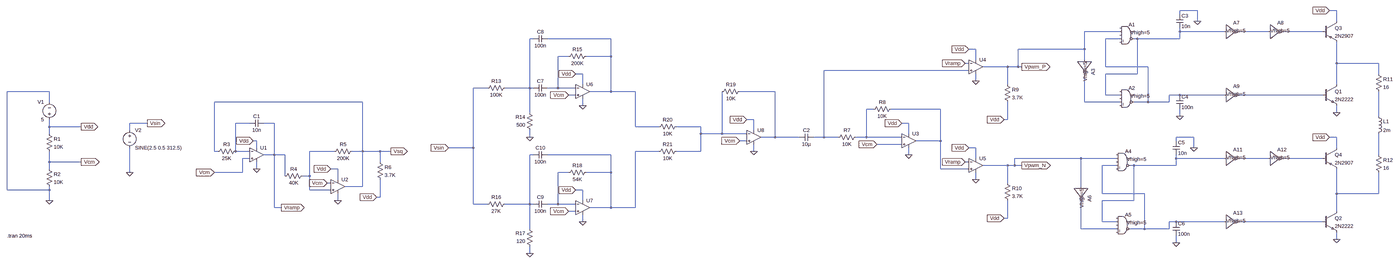
[diagram p0: schematic TOP LEVEL INTEGRATION.asc, whole sheet]
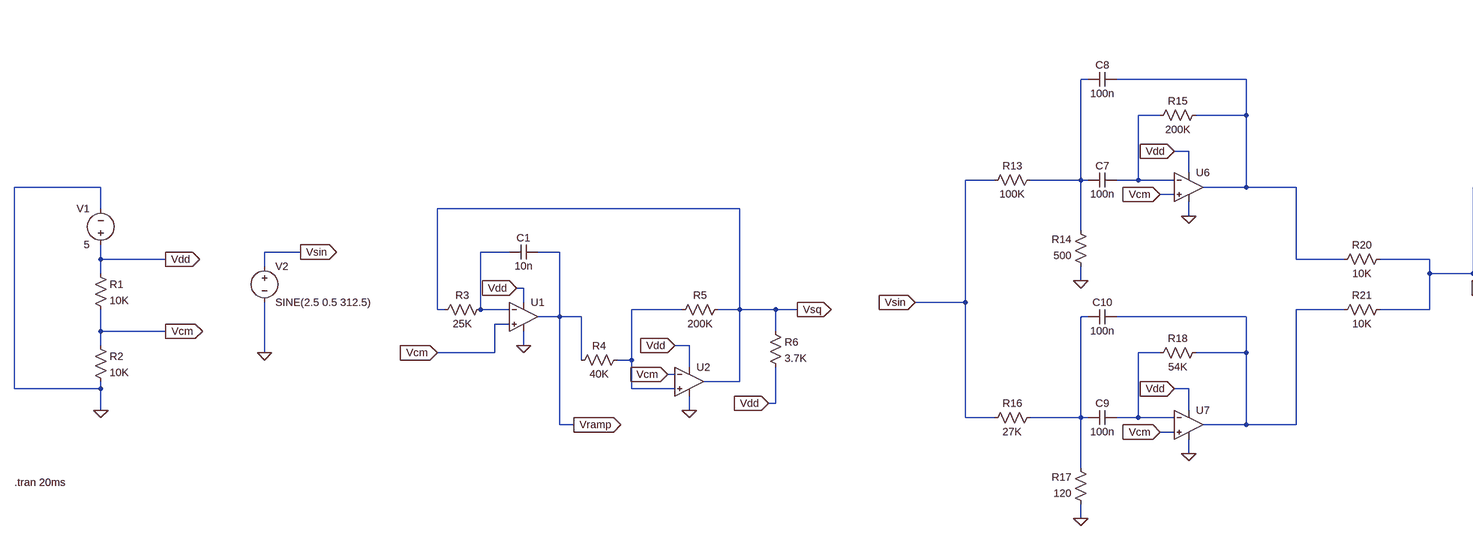
[diagram p1: schematic TOP LEVEL INTEGRATION.asc, part, row 1 of 1, column 1 of 2]
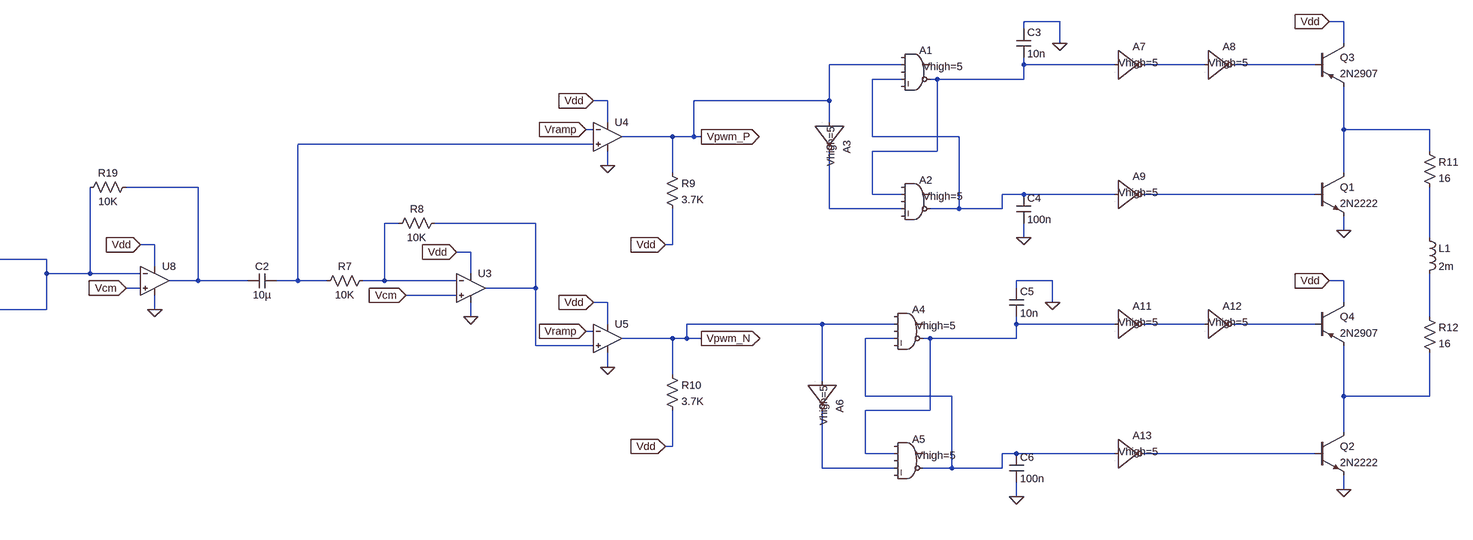
[diagram p2: schematic TOP LEVEL INTEGRATION.asc, part, row 1 of 1, column 2 of 2]
TOP LEVEL INTEGRATION.asc, the LTspice schematic file:
Version 4.1
SHEET 1 3748 680
WIRE 2416 -608 2336 -608
WIRE 3392 -608 3360 -608
WIRE 2336 -592 2336 -608
WIRE 2416 -560 2416 -608
WIRE 3392 -560 3392 -608
WIRE 2064 -512 1904 -512
WIRE 2336 -512 2336 -528
WIRE 2640 -512 2336 -512
WIRE 2928 -512 2704 -512
WIRE 3328 -512 2992 -512
WIRE -1088 -480 -1104 -480
WIRE -736 -480 -1024 -480
WIRE 2064 -480 2000 -480
WIRE 2144 -480 2128 -480
WIRE 2336 -480 2336 -512
WIRE 2336 -480 2144 -480
WIRE 1248 -432 1216 -432
WIRE 1904 -432 1904 -512
WIRE 1904 -432 1440 -432
WIRE -928 -400 -976 -400
WIRE -736 -400 -736 -480
WIRE -736 -400 -848 -400
WIRE 1248 -384 1248 -432
WIRE 1904 -384 1904 -432
WIRE 1216 -368 1200 -368
WIRE 3392 -368 3392 -464
WIRE 3680 -368 3392 -368
WIRE 1392 -352 1280 -352
WIRE 1440 -352 1440 -432
WIRE 1440 -352 1392 -352
WIRE 1456 -352 1440 -352
WIRE 2000 -352 2000 -480
WIRE 2192 -352 2000 -352
WIRE 1216 -336 560 -336
WIRE -864 -320 -896 -320
WIRE 2144 -320 2144 -480
WIRE 2144 -320 2000 -320
WIRE 3680 -320 3680 -368
WIRE 1248 -288 1248 -320
WIRE -864 -272 -864 -320
WIRE 1392 -272 1392 -352
WIRE 3392 -272 3392 -368
WIRE -1296 -256 -1360 -256
WIRE -1104 -256 -1104 -480
WIRE -1104 -256 -1216 -256
WIRE -1088 -256 -1104 -256
WIRE -976 -256 -976 -400
WIRE -976 -256 -1024 -256
WIRE -896 -256 -976 -256
WIRE -3600 -240 -3792 -240
WIRE -736 -240 -736 -400
WIRE -736 -240 -832 -240
WIRE -624 -240 -736 -240
WIRE 176 -240 16 -240
WIRE -896 -224 -928 -224
WIRE 2000 -224 2000 -320
WIRE 2064 -224 2000 -224
WIRE 2336 -224 2288 -224
WIRE 2640 -224 2336 -224
WIRE 3328 -224 2704 -224
WIRE -3600 -192 -3600 -240
WIRE -2112 -192 -2784 -192
WIRE 1904 -192 1904 -320
WIRE 2064 -192 1904 -192
WIRE 2192 -192 2192 -352
WIRE 2192 -192 2128 -192
WIRE 2288 -192 2288 -224
WIRE 2288 -192 2192 -192
WIRE -864 -176 -864 -208
WIRE 784 -160 752 -160
WIRE 1088 -160 864 -160
WIRE -1104 -144 -1104 -256
WIRE 3392 -144 3392 -176
WIRE 2336 -128 2336 -160
WIRE 3680 -128 3680 -240
WIRE 80 -112 48 -112
WIRE 1392 -112 1392 -192
WIRE 1392 -112 1376 -112
WIRE -3088 -96 -3168 -96
WIRE -2624 -96 -2688 -96
WIRE -2512 -96 -2560 -96
WIRE 944 -96 912 -96
WIRE -3600 -80 -3600 -112
WIRE -3456 -80 -3600 -80
WIRE -624 -80 -624 -240
WIRE -384 -80 -624 -80
WIRE -160 -80 -304 -80
WIRE -3168 -64 -3168 -96
WIRE 80 -64 80 -112
WIRE -3600 -48 -3600 -80
WIRE -160 -48 -160 -80
WIRE -64 -48 -64 -240
WIRE -64 -48 -160 -48
WIRE 48 -48 -64 -48
WIRE 944 -48 944 -96
WIRE -1104 -32 -1104 -64
WIRE 176 -32 176 -240
WIRE 176 -32 112 -32
WIRE 448 -32 176 -32
WIRE 560 -32 560 -336
WIRE 560 -32 512 -32
WIRE 624 -32 560 -32
WIRE 752 -32 752 -160
WIRE 752 -32 704 -32
WIRE 912 -32 752 -32
WIRE 2400 -32 2320 -32
WIRE 3392 -32 3360 -32
WIRE -2592 -16 -2608 -16
WIRE 48 -16 16 -16
WIRE 1088 -16 1088 -160
WIRE 1088 -16 976 -16
WIRE 2320 -16 2320 -32
WIRE 912 0 800 0
WIRE -2592 16 -2592 -16
WIRE -1360 16 -1360 -256
WIRE -1360 16 -1552 16
WIRE 1248 16 1216 16
WIRE 2400 16 2400 -32
WIRE 3392 16 3392 -32
WIRE -2784 32 -2784 -192
WIRE -2768 32 -2784 32
WIRE -2688 32 -2688 -96
WIRE -2624 32 -2688 32
WIRE -2240 32 -2352 32
WIRE -2112 32 -2112 -192
WIRE -2112 32 -2160 32
WIRE -2032 32 -2112 32
WIRE -1984 32 -2032 32
WIRE -384 32 -624 32
WIRE -160 32 -160 -48
WIRE -160 32 -304 32
WIRE 80 32 80 0
WIRE -2512 48 -2512 -96
WIRE -2512 48 -2560 48
WIRE -2464 48 -2512 48
WIRE -1088 48 -1104 48
WIRE -736 48 -1024 48
WIRE 944 48 944 16
WIRE 3680 48 3680 -48
WIRE -2624 64 -2656 64
WIRE 1248 64 1248 16
WIRE 1888 64 1424 64
WIRE 2048 64 1888 64
WIRE 2320 64 2320 48
WIRE 2640 64 2320 64
WIRE 2928 64 2704 64
WIRE 3328 64 2992 64
WIRE -3600 80 -3600 32
WIRE -3456 80 -3600 80
WIRE -2032 80 -2032 32
WIRE 1216 80 1200 80
WIRE 1392 96 1280 96
WIRE 1424 96 1424 64
WIRE 1424 96 1392 96
WIRE 1456 96 1424 96
WIRE 2048 96 1984 96
WIRE 2128 96 2112 96
WIRE 2320 96 2320 64
WIRE 2320 96 2128 96
WIRE -3600 112 -3600 80
WIRE -2592 112 -2592 80
WIRE -2224 112 -2256 112
WIRE 1088 112 1088 -16
WIRE 1216 112 1088 112
WIRE -3168 128 -3168 16
WIRE -2656 128 -2656 64
WIRE -2656 128 -2784 128
WIRE -928 128 -976 128
WIRE -736 128 -736 48
WIRE -736 128 -848 128
WIRE -2464 144 -2464 48
WIRE -2352 144 -2352 32
WIRE -2352 144 -2384 144
WIRE -2224 160 -2224 112
WIRE 1248 160 1248 128
WIRE -2256 176 -2272 176
WIRE 1392 176 1392 96
WIRE -2112 192 -2112 32
WIRE -2112 192 -2192 192
WIRE 1888 192 1888 64
WIRE -3792 208 -3792 -240
WIRE -3600 208 -3600 192
WIRE -3600 208 -3792 208
WIRE -2352 208 -2352 144
WIRE -2256 208 -2352 208
WIRE -864 208 -896 208
WIRE 1984 224 1984 96
WIRE 2176 224 1984 224
WIRE 3392 224 3392 112
WIRE 3680 224 3680 128
WIRE 3680 224 3392 224
WIRE -2032 240 -2032 160
WIRE -2032 240 -2048 240
WIRE -3600 256 -3600 208
WIRE -2224 256 -2224 224
WIRE -864 256 -864 208
WIRE 2128 256 2128 96
WIRE 2128 256 1984 256
WIRE -1360 272 -1360 16
WIRE -1296 272 -1360 272
WIRE -1104 272 -1104 48
WIRE -1104 272 -1216 272
WIRE -1088 272 -1104 272
WIRE -976 272 -976 128
WIRE -976 272 -1024 272
WIRE -896 272 -976 272
WIRE -2512 288 -2512 48
WIRE -2480 288 -2512 288
WIRE -736 288 -736 128
WIRE -736 288 -832 288
WIRE -624 288 -624 32
WIRE -624 288 -736 288
WIRE -896 304 -928 304
WIRE 3392 304 3392 224
WIRE 1392 336 1392 256
WIRE 1392 336 1376 336
WIRE -864 352 -864 320
WIRE 1984 352 1984 256
WIRE 2048 352 1984 352
WIRE 2320 352 2288 352
WIRE 2640 352 2320 352
WIRE 3328 352 2704 352
WIRE -1104 384 -1104 272
WIRE 1888 384 1888 256
WIRE 2048 384 1888 384
WIRE 2176 384 2176 224
WIRE 2176 384 2112 384
WIRE 2288 384 2288 352
WIRE 2288 384 2176 384
WIRE 3392 432 3392 400
WIRE 2320 448 2320 416
WIRE -1104 496 -1104 464
FLAG -3600 256 0
FLAG -3456 80 Vcm
IOPIN -3456 80 Out
FLAG -3456 -80 Vdd
IOPIN -3456 -80 Out
FLAG -2784 128 Vcm
IOPIN -2784 128 In
FLAG -2608 -16 Vdd
IOPIN -2608 -16 In
FLAG -2256 112 Vdd
IOPIN -2256 112 In
FLAG -2592 112 0
FLAG -2224 256 0
FLAG -2272 176 Vcm
IOPIN -2272 176 In
FLAG -2480 288 Vramp
IOPIN -2480 288 Out
FLAG -1984 32 Vsq
IOPIN -1984 32 Out
FLAG -2048 240 Vdd
IOPIN -2048 240 In
FLAG 912 -96 Vdd
IOPIN 912 -96 In
FLAG 944 48 0
FLAG 800 0 Vcm
IOPIN 800 0 In
FLAG -1552 16 Vsin
IOPIN -1552 16 In
FLAG -3168 128 0
FLAG -3088 -96 Vsin
IOPIN -3088 -96 Out
FLAG 1216 -432 Vdd
IOPIN 1216 -432 In
FLAG 1248 -288 0
FLAG 1200 -368 Vramp
IOPIN 1200 -368 In
FLAG 1216 16 Vdd
IOPIN 1216 16 In
FLAG 1248 160 0
FLAG 1200 80 Vramp
IOPIN 1200 80 In
FLAG 1456 -352 Vpwm_P
IOPIN 1456 -352 Out
FLAG 1456 96 Vpwm_N
IOPIN 1456 96 Out
FLAG 1376 -112 Vdd
IOPIN 1376 -112 In
FLAG 1376 336 Vdd
IOPIN 1376 336 In
FLAG 2416 -560 0
FLAG 2336 -128 0
FLAG 2400 16 0
FLAG 2320 448 0
FLAG 3392 -144 0
FLAG 3392 432 0
FLAG 3360 -608 Vdd
IOPIN 3360 -608 In
FLAG 3360 -32 Vdd
IOPIN 3360 -32 In
FLAG -896 -320 Vdd
IOPIN -896 -320 In
FLAG -864 -176 0
FLAG -1104 -32 0
FLAG -896 208 Vdd
IOPIN -896 208 In
FLAG -864 352 0
FLAG -1104 496 0
FLAG 48 -112 Vdd
IOPIN 48 -112 In
FLAG 80 32 0
FLAG -928 -224 Vcm
IOPIN -928 -224 In
FLAG -928 304 Vcm
IOPIN -928 304 In
FLAG 16 -16 Vcm
IOPIN 16 -16 In
SYMBOL res -3616 -64 R0
SYMATTR InstName R1
SYMATTR Value 10K
SYMBOL res -3616 96 R0
SYMATTR InstName R2
SYMATTR Value 10K
SYMBOL OpAmps\\UniversalOpAmp1 -2592 48 R0
SYMATTR InstName U1
SYMBOL res -2672 16 R90
WINDOW 0 0 56 VBottom 2
WINDOW 3 32 56 VTop 2
SYMATTR InstName R3
SYMATTR Value 25K
SYMBOL voltage -3600 -96 R180
WINDOW 0 24 96 Left 2
WINDOW 3 24 16 Left 2
WINDOW 123 0 0 Left 0
WINDOW 39 0 0 Left 0
SYMATTR InstName V1
SYMATTR Value 5
SYMBOL OpAmps\\UniversalOpAmp2 -2224 192 R0
SYMATTR InstName U2
SYMBOL res -2368 128 R90
WINDOW 0 0 56 VBottom 2
WINDOW 3 32 56 VTop 2
SYMATTR InstName R4
SYMATTR Value 40K
SYMBOL res -2144 16 R90
WINDOW 0 0 56 VBottom 2
WINDOW 3 32 56 VTop 2
SYMATTR InstName R5
SYMATTR Value 200K
SYMBOL cap -2560 -112 R90
WINDOW 0 0 32 VBottom 2
WINDOW 3 32 32 VTop 2
SYMATTR InstName C1
SYMATTR Value 10n
SYMBOL res -2048 64 R0
SYMATTR InstName R6
SYMATTR Value 3.7K
SYMBOL OpAmps\\UniversalOpAmp2 944 -16 R0
SYMATTR InstName U3
SYMBOL res 720 -48 R90
WINDOW 0 0 56 VBottom 2
WINDOW 3 32 56 VTop 2
SYMATTR InstName R7
SYMATTR Value 10K
SYMBOL res 880 -176 R90
WINDOW 0 0 56 VBottom 2
WINDOW 3 32 56 VTop 2
SYMATTR InstName R8
SYMATTR Value 10K
SYMBOL cap 448 -48 M90
WINDOW 0 0 32 VBottom 2
WINDOW 3 32 32 VTop 2
SYMATTR InstName C2
SYMATTR Value 10µ
SYMATTR SpiceLine Irms=0
SYMBOL voltage -3168 -80 R0
WINDOW 123 0 0 Left 0
WINDOW 39 0 0 Left 0
SYMATTR InstName V2
SYMATTR Value SINE(2.5 0.5 312.5)
SYMBOL OpAmps\\UniversalOpAmp2 1248 -352 R0
SYMATTR InstName U4
SYMBOL OpAmps\\UniversalOpAmp2 1248 96 R0
SYMATTR InstName U5
SYMBOL res 1376 -288 R0
SYMATTR InstName R9
SYMATTR Value 3.7K
SYMBOL res 1376 160 R0
SYMATTR InstName R10
SYMATTR Value 3.7K
SYMBOL Digital\\and 2096 -560 R0
WINDOW 3 16 52 Left 2
SYMATTR InstName A1
SYMATTR Value Vhigh=5
SYMBOL Digital\\and 2096 -272 R0
WINDOW 3 16 52 Left 2
SYMATTR InstName A2
SYMATTR Value Vhigh=5
SYMBOL Digital\\inv 1968 -384 R90
WINDOW 3 8 60 Left 2
SYMATTR InstName A3
SYMATTR Value Vhigh=5
SYMBOL cap 2320 -592 R0
SYMATTR InstName C3
SYMATTR Value 10n
SYMBOL cap 2320 -224 R0
SYMATTR InstName C4
SYMATTR Value 100n
SYMBOL Digital\\and 2080 16 R0
WINDOW 3 16 52 Left 2
SYMATTR InstName A4
SYMATTR Value Vhigh=5
SYMBOL Digital\\and 2080 304 R0
WINDOW 3 16 52 Left 2
SYMATTR InstName A5
SYMATTR Value Vhigh=5
SYMBOL Digital\\inv 1952 192 R90
WINDOW 3 8 60 Left 2
SYMATTR InstName A6
SYMATTR Value Vhigh=5
SYMBOL cap 2304 -16 R0
SYMATTR InstName C5
SYMATTR Value 10n
SYMBOL cap 2304 352 R0
SYMATTR InstName C6
SYMATTR Value 100n
SYMBOL Digital\\inv 2640 -576 R0
WINDOW 3 8 60 Left 2
SYMATTR InstName A7
SYMATTR Value Vhigh=5
SYMBOL Digital\\inv 2928 -576 R0
WINDOW 3 8 60 Left 2
SYMATTR InstName A8
SYMATTR Value Vhigh=5
SYMBOL Digital\\inv 2640 -288 R0
WINDOW 3 8 60 Left 2
SYMATTR InstName A9
SYMATTR Value Vhigh=5
SYMBOL npn 3328 -272 R0
SYMATTR InstName Q1
SYMATTR Value 2N2222
SYMBOL res 3664 -336 R0
SYMATTR InstName R11
SYMATTR Value 16
SYMBOL res 3664 32 R0
SYMATTR InstName R12
SYMATTR Value 16
SYMBOL Digital\\inv 2640 0 R0
WINDOW 3 8 60 Left 2
SYMATTR InstName A11
SYMATTR Value Vhigh=5
SYMBOL Digital\\inv 2928 0 R0
WINDOW 3 8 60 Left 2
SYMATTR InstName A12
SYMATTR Value Vhigh=5
SYMBOL Digital\\inv 2640 288 R0
WINDOW 3 8 60 Left 2
SYMATTR InstName A13
SYMATTR Value Vhigh=5
SYMBOL npn 3328 304 R0
SYMATTR InstName Q2
SYMATTR Value 2N2222
SYMBOL pnp 3328 -560 R0
SYMATTR InstName Q3
SYMATTR Value 2N2907
SYMBOL pnp 3328 16 R0
SYMATTR InstName Q4
SYMATTR Value 2N2907
SYMBOL OpAmps\\UniversalOpAmp2 -864 -240 R0
SYMATTR InstName U6
SYMBOL res -1200 -272 R90
WINDOW 0 0 56 VBottom 2
WINDOW 3 32 56 VTop 2
SYMATTR InstName R13
SYMATTR Value 100K
SYMBOL res -1088 -48 R180
WINDOW 0 36 76 Left 2
WINDOW 3 36 40 Left 2
SYMATTR InstName R14
SYMATTR Value 500
SYMBOL res -944 -384 R270
WINDOW 0 32 56 VTop 2
WINDOW 3 0 56 VBottom 2
SYMATTR InstName R15
SYMATTR Value 200K
SYMBOL cap -1024 -272 R90
WINDOW 0 0 32 VBottom 2
WINDOW 3 32 32 VTop 2
SYMATTR InstName C7
SYMATTR Value 100n
SYMBOL cap -1024 -496 R90
WINDOW 0 0 32 VBottom 2
WINDOW 3 32 32 VTop 2
SYMATTR InstName C8
SYMATTR Value 100n
SYMBOL OpAmps\\UniversalOpAmp2 -864 288 R0
SYMATTR InstName U7
SYMBOL res -1200 256 R90
WINDOW 0 0 56 VBottom 2
WINDOW 3 32 56 VTop 2
SYMATTR InstName R16
SYMATTR Value 27K
SYMBOL res -1088 480 R180
WINDOW 0 36 76 Left 2
WINDOW 3 36 40 Left 2
SYMATTR InstName R17
SYMATTR Value 120
SYMBOL res -944 144 R270
WINDOW 0 32 56 VTop 2
WINDOW 3 0 56 VBottom 2
SYMATTR InstName R18
SYMATTR Value 54K
SYMBOL cap -1024 256 R90
WINDOW 0 0 32 VBottom 2
WINDOW 3 32 32 VTop 2
SYMATTR InstName C9
SYMATTR Value 100n
SYMBOL cap -1024 32 R90
WINDOW 0 0 32 VBottom 2
WINDOW 3 32 32 VTop 2
SYMATTR InstName C10
SYMATTR Value 100n
SYMBOL OpAmps\\UniversalOpAmp2 80 -32 R0
SYMATTR InstName U8
SYMBOL res 32 -256 R90
WINDOW 0 0 56 VBottom 2
WINDOW 3 32 56 VTop 2
SYMATTR InstName R19
SYMATTR Value 10K
SYMBOL res -288 -96 R90
WINDOW 0 0 56 VBottom 2
WINDOW 3 32 56 VTop 2
SYMATTR InstName R20
SYMATTR Value 10K
SYMBOL res -288 16 R90
WINDOW 0 0 56 VBottom 2
WINDOW 3 32 56 VTop 2
SYMATTR InstName R21
SYMATTR Value 10K
SYMBOL ind 3664 -144 R0
SYMATTR InstName L1
SYMATTR Value 2m
SYMATTR SpiceLine Rser=1m
TEXT -3792 416 Left 2 !.tran 20ms

The netlist it stands for:
* TOP LEVEL INTEGRATION.asc
R1 Vdd Vcm 10K
R2 Vcm 0 10K
X§U1 Vcm N016 Vdd 0 Vramp level1 Avol=1Meg GBW=10Meg Vos=0 En=0 Enk=0 In=0 Ink=0 Rin=500Meg  ; pins In+ In- V+ V- OUT
R3 N016 Vsq 25K
V1 Vdd 0 5
X§U2 N018 Vcm Vdd 0 Vsq level2 Avol=1Meg GBW=10Meg Slew=10Meg Ilimit=25m Rail=0 Vos=0 En=0 Enk=0 In=0 Ink=0 Rin=500Meg  ; pins In+ In- V+ V- OUT
R4 N018 Vramp 40K
R5 Vsq N018 200K
C1 Vramp N016 10n
R6 Vsq Vdd 3.7K
X§U3 Vcm N013 Vdd 0 N014 level2 Avol=1Meg GBW=10Meg Slew=10Meg Ilimit=25m Rail=0 Vos=0 En=0 Enk=0 In=0 Ink=0 Rin=500Meg  ; pins In+ In- V+ V- OUT
R7 N013 N009 10K
R8 N014 N013 10K
C2 N010 N009 10µ Irms=0
V2 Vsin 0 SINE(2.5 0.5 312.5)
X§U4 N009 Vramp Vdd 0 Vpwm_P level2 Avol=1Meg GBW=10Meg Slew=10Meg Ilimit=25m Rail=0 Vos=0 En=0 Enk=0 In=0 Ink=0 Rin=500Meg  ; pins In+ In- V+ V- OUT
X§U5 N014 Vramp Vdd 0 Vpwm_N level2 Avol=1Meg GBW=10Meg Slew=10Meg Ilimit=25m Rail=0 Vos=0 En=0 Enk=0 In=0 Ink=0 Rin=500Meg  ; pins In+ In- V+ V- OUT
R9 Vpwm_P Vdd 3.7K
R10 Vpwm_N Vdd 3.7K
A1 0 Vpwm_P 0 N006 0 N001 0 0 AND Vhigh=5
A2 0 N001 0 N012 0 N006 0 0 AND Vhigh=5
A3 Vpwm_P 0 0 0 0 N012 0 0 BUF Vhigh=5
C3 0 N001 10n
C4 N006 0 100n
A4 0 Vpwm_N 0 N025 0 N022 0 0 AND Vhigh=5
A5 0 N022 0 N029 0 N025 0 0 AND Vhigh=5
A6 Vpwm_N 0 0 0 0 N029 0 0 BUF Vhigh=5
C5 0 N022 10n
C6 N025 0 100n
A7 N001 0 0 0 0 N002 0 0 BUF Vhigh=5
A8 N002 0 0 0 0 N003 0 0 BUF Vhigh=5
A9 N006 0 0 0 0 N011 0 0 BUF Vhigh=5
Q1 N008 N011 0 0 2N2222
R11 N008 N015 16
R12 N021 N027 16
A11 N022 0 0 0 0 N023 0 0 BUF Vhigh=5
A12 N023 0 0 0 0 N024 0 0 BUF Vhigh=5
A13 N025 0 0 0 0 N028 0 0 BUF Vhigh=5
Q2 N027 N028 0 0 2N2222
Q3 Vdd N003 N008 0 2N2907
Q4 Vdd N024 N027 0 2N2907
X§U6 Vcm N007 Vdd 0 N005 level2 Avol=1Meg GBW=10Meg Slew=10Meg Ilimit=25m Rail=0 Vos=0 En=0 Enk=0 In=0 Ink=0 Rin=500Meg  ; pins In+ In- V+ V- OUT
R13 N004 Vsin 100K
R14 0 N004 500
R15 N007 N005 200K
C7 N007 N004 100n
C8 N005 N004 100n
X§U7 Vcm N026 Vdd 0 N019 level2 Avol=1Meg GBW=10Meg Slew=10Meg Ilimit=25m Rail=0 Vos=0 En=0 Enk=0 In=0 Ink=0 Rin=500Meg  ; pins In+ In- V+ V- OUT
R16 N020 Vsin 27K
R17 0 N020 120
R18 N026 N019 54K
C9 N026 N020 100n
C10 N019 N020 100n
X§U8 Vcm N017 Vdd 0 N010 level2 Avol=1Meg GBW=10Meg Slew=10Meg Ilimit=25m Rail=0 Vos=0 En=0 Enk=0 In=0 Ink=0 Rin=500Meg  ; pins In+ In- V+ V- OUT
R19 N010 N017 10K
R20 N017 N005 10K
R21 N017 N019 10K
L1 N015 N021 2m Rser=1m
.model NPN NPN
.model PNP PNP
.lib standard.bjt
.tran 20ms
.lib UniversalOpAmp1.lib
.lib UniversalOpAmp2.lib
.backanno
.end